# Altium schematic sheet SRD Generator Sheme.SchDoc
size A4; SheetNumber: 1; SheetTotal: 1
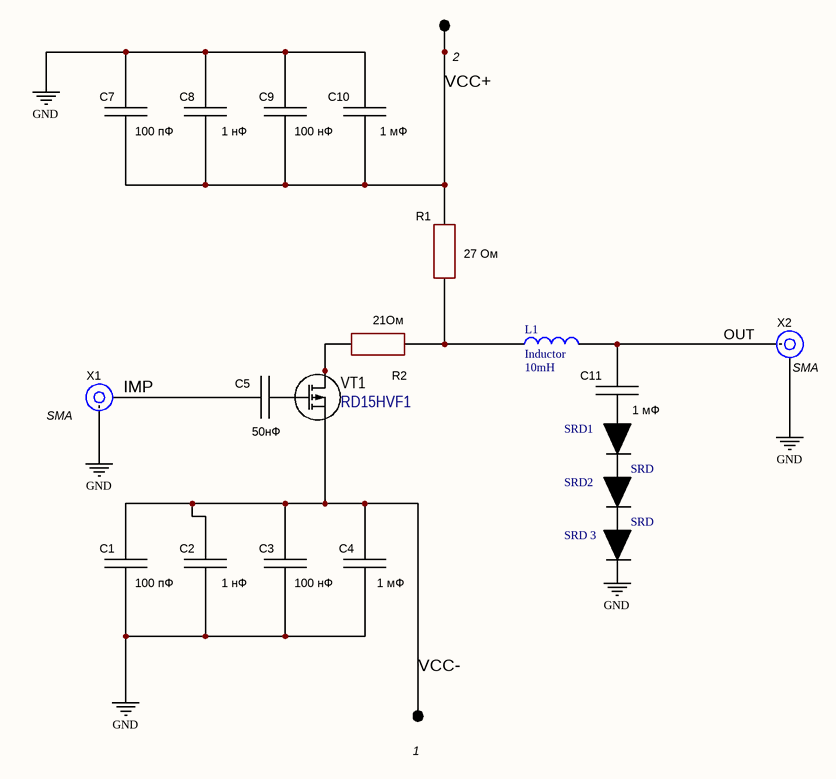
[diagram p0: SRD Generator Sheme.SchDoc]

## Parts
1  (no value)  [Soldered contact]  (no BOM)
2  (no value)  [Soldered contact]  (no BOM)
C1  100 пФ  [CH0603C]
C2  1 нФ  [CH0603C]
C3  100 нФ  [CH0603C]
C4  1 мФ  [CH0603C]
C5  50нФ  [CH0603C]
C7  100 пФ  [CH0603C]
C8  1 нФ  [CH0603C]
C9  100 нФ  [CH0603C]
C10  1 мФ  [CH0603C]
C11  1 мФ  [CH0603C]
L1  Inductor  value 10mH  [0402-A]
R1  27 Ом  [CH0603R]
R2  21Ом  [CH0603R]
SRD1  SRD  [PCBComponent_1 - duplicate]
SRD2  SRD  [PCBComponent_1 - duplicate]
VT1  RD15HVF1  [TO220_123]
X1  SMA  [CON: SMA-R]
X2  SMA  [CON: SMA-R]
  SRD 3  [PCBComponent_1 - duplicate]

## Nets
GND: C1.1 C2.1 C3.1 C4.1 C7.2 C8.2 C9.2 C10.2 X1.2(IN) X2.2(IN)
IMP: C5.1 X1.1(IN)
OUT: C11.2 L1.2 X2.1(IN)
VCC+: 2.1 C7.1 C8.1 C9.1 C10.1 R1.2
VCC-: 1.1 C1.2 C2.2 C3.2 C4.2 VT1.3(S)
NetC5_2: C5.2 VT1.1(G)
NetC11_1: C11.1 .1
NetL1_1: L1.1 R1.1 R2.1
NetR2_2: R2.2 VT1.2(D)

Not connected (* = marked no-connect by the designer): SRD1 1(4) 2(5); SRD2 1(4) 2(5);  2(5)

## Notes on the sheet
- Labels drawn without touching a wire or pin: GND

## Library data of the parts
1 2 = Паянный контакт
C1-C4 C7-C11 = Capacitor: Value: 50 нФ; Manufacturer: *; Model: *; HelpURL: *; ComponentKind: *; Name: *
C5 = Capacitor_1: Value: 100 нФ; Manufacturer: *; Model: *; HelpURL: *; ComponentKind: *; Name: *
L1 = Inductor: Code_IEC: 1005; Published: 8-Jun-2000; LatestRevisionDate: 29-May-2009; LatestRevisionNote: IPC-7351 Footprint Added.; PackageReference: 0402-A; Publisher: Altium Limited; PackageDescription: Chip Inductor; Code_JEITA: 0402
R1 R2 = Resistor_1: Manufacturer: *; Model: *; HelpURL: *; ComponentKind: *; Name: *
  R1: Value: 27 Ом
  R2: Value: 21Ом
SRD1 SRD2  = SRD: https://ru.mouser.com/datasheet/2/249/maom_s_a0004987266_1-2274246.pdf
VT1 = P-chanel -diod: Mosfet; Model: RD15HVF1; Manufacturer: *; ComponentKind: *; HelpURL: http://www.mitsubishielectric.com/semiconductors/content/product/highfrequency/siliconrf/discrete/rd15hvf1.pdf
X1 X2 = SMA: RF; Model: *; Manufacturer: *; ComponentKind: *; Docs: *